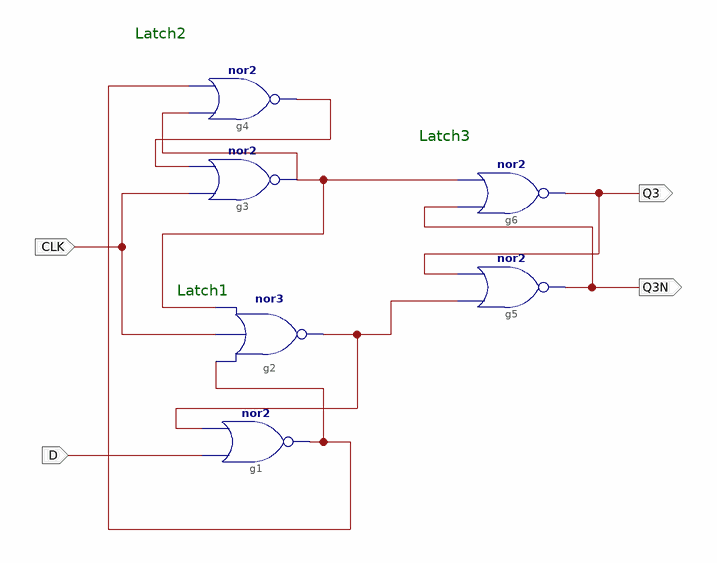
[diagram p0: schematic sheet 1]
// Xilinx ISE schematic FFD.sch (spartan3e) as structural Verilog: 6 symbols, 4 ports
module FFD (
  input  D,
  input  CLK,
  output Q3,
  output Q3N
);

  wire Q1, Q1N, Q2, Q2N;

  nor g4 (Q2, Q2N, Q1N);
  nor g5 (Q3N, Q1, Q3);
  nor g2 (Q1, Q1N, CLK, Q2N);
  nor g1 (Q1N, D, Q1);
  nor g6 (Q3, Q3N, Q2N);
  nor g3 (Q2N, CLK, Q2);

  // Notes on the sheet:
  //   Latch2
  //   Latch3
  //   Latch1
endmodule
